# Altium project Ignition.PrjPcb
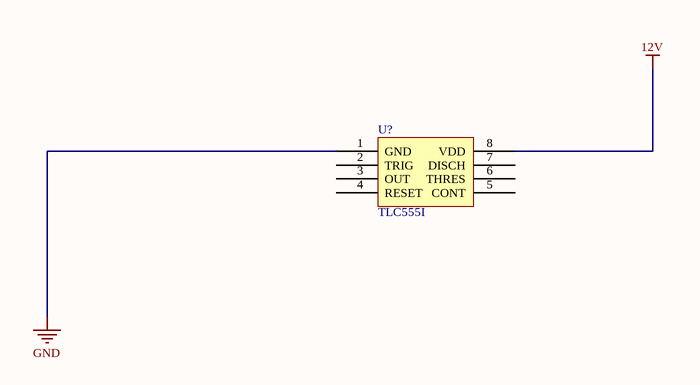
[diagram p0: IgnitionCoil.SchDoc]
1 sheet, 1 parts. Net scope: global (net labels, ports and power ports of the same name join across sheets).
Board file: IgnitionCoil.PcbDoc

## Sheet IgnitionCoil.SchDoc
size Tabloid

### Parts
U?  TLC555I

### Nets
12V: U?.8(VDD)
GND: U?.1(GND)

Not connected (* = marked no-connect by the designer): U? 2(TRIG) 3(OUT) 4(RESET) 5(CONT) 6(THRES) 7(DISCH)

### Library data of the parts
U? = TLC555I: Manufacturer: Texas Instrument; Package: SOIC-8; Manufacturer P/N: TLC555I